# Altium schematic sheet Display.SchDoc
size A4; SheetNumber: 2; SheetTotal: 5
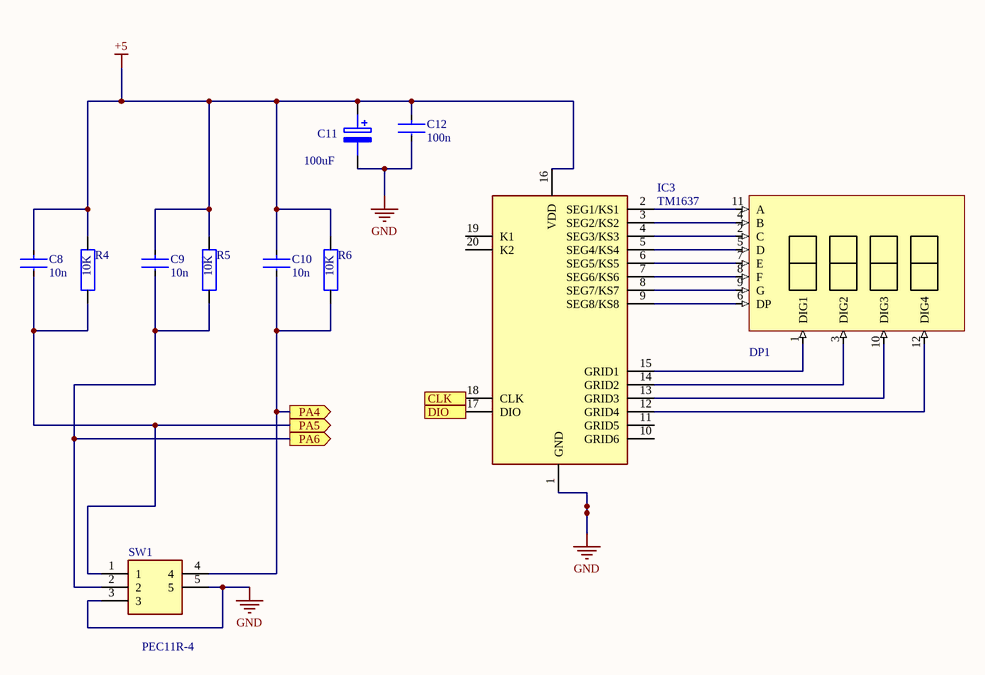
[diagram p0: Display.SchDoc]

## Parts
C8  10n  [FP-C0805C-DN-IPC_A]
C9  10n  [FP-C0805C-DN-IPC_A]
C10  10n  [FP-C0805C-DN-IPC_A]
C11  100uF  [caprad100mil]
C12  100n  [FP-C0805C-DN-IPC_A]
DP1  ELCO220uF  [display]  (value not drawn)
IC3  TM1637  [DIP778W53P254L2612H431Q20N]
R4  10K  [res0805ph]
R5  10K  [res0805ph]
R6  10K  [res0805ph]
SW1  PEC11R-4  [PEC12R-4XXXF-SXXXX_1]

## Ports
CLK (out), DIO (out), PA4 (out), PA5 (out), PA6 (out)

## Nets
+5: C8.1 C9.1 C10.1 C11.1(+) C12.1 IC3.16(VDD) R4.1 R5.1 R6.1
GND: C11.2(-) C12.2 IC3.1(GND) SW1.3 SW1.5
CLK: IC3.18(CLK) ; port CLK
DIO: IC3.17(DIO) ; port DIO
PA4: C10.2 R6.2 SW1.4 ; port PA4
PA5: C8.2 R4.2 SW1.1 ; port PA5
PA6: C9.2 R5.2 SW1.2 ; port PA6
NetDP1_1: DP1.1(DIG1) IC3.15(GRID1)
NetDP1_2: DP1.2(C) IC3.4(SEG3/KS3)
NetDP1_3: DP1.3(DIG2) IC3.14(GRID2)
NetDP1_4: DP1.4(B) IC3.3(SEG2/KS2)
NetDP1_5: DP1.5(D) IC3.5(SEG4/KS4)
NetDP1_6: DP1.6(DP) IC3.9(SEG8/KS8)
NetDP1_7: DP1.7(E) IC3.6(SEG5/KS5)
NetDP1_8: DP1.8(F) IC3.7(SEG6/KS6)
NetDP1_9: DP1.9(G) IC3.8(SEG7/KS7)
NetDP1_10: DP1.10(DIG3) IC3.13(GRID3)
NetDP1_11: DP1.11(A) IC3.2(SEG1/KS1)
NetDP1_12: DP1.12(DIG4) IC3.12(GRID4)

Not connected (* = marked no-connect by the designer): IC3 10(GRID6) 11(GRID5) 19(K1) 20(K2)

## Library data of the parts
C8-C10 C12 = CMP-2007-00259-2: CAP CER 10000PF 200V X7R 0805; Manufacturer Part Number: C0805C103K2RACTU; Manufacturer: KEMET; Material: Ceramic; Temperature Coefficient: 30ppm/°C; Capacitance: 10,000 pF; Tolerance: 0.1; Value: 10,000 pF; Device Class L2: Capacitors; Voltage Rating: 200 V; Temperature Range High: +125°C; ComponentLink2Description: Datasheet; Height: 0.88mm; Octopart: https://octopart.com/c0805c103k2ractu-kemet-9138347; ComponentLink2URL: https://content.kemet.com/datasheets/KEM_C1003_C0G_SMD.pdf; Category: Cap; Temperature: -55°C to +125°C; Temperature Range Low: -55°C; Digikey Description: CAP CER 10000PF 200V X7R 0805; Temperature Characteristic: X7R; Automotive: No; Device Class L3: Ceramic Capacitors; Mouser Description: KEMET - C0805C103K2RACTU - CAP, MLCC, X7R, 10NF, 200V, 0805; RoHS: TRUE; Device Class L1: Passive Components; Lead Free: Yes; Package: C0805C-DN; Ipc Land Pattern Name: CAPC200125X78
C11 = ELCO220uF: Capacitor Polarised; Manufacturer_Name: Kemet; Manufacturer_Part_Number: T494D227K006AT; Datasheet Link: https://datasheet.datasheetarchive.com/originals/distributors/Datasheets-DGA21/1893029.pdf; Height: 3.1mm; Mouser Part Number: 80-T494D227K006; Mouser Price/Stock: https://www.mouser.co.uk/ProductDetail/KEMET/T494D227K006AT/?qs=KZyWKl2lJVCDSHmnBye8LQ%3D%3D
DP1 = Display: Capacitor Polarised; Manufacturer_Name: Kemet; Manufacturer_Part_Number: T494D227K006AT; Datasheet Link: https://datasheet.datasheetarchive.com/originals/distributors/Datasheets-DGA21/1893029.pdf; Height: 3.1mm; Mouser Part Number: 80-T494D227K006; Mouser Price/Stock: https://www.mouser.co.uk/ProductDetail/KEMET/T494D227K006AT/?qs=KZyWKl2lJVCDSHmnBye8LQ%3D%3D
IC3 = TM1637: Integrated Circuit; Manufacturer_Name: TITAN MICRO ELECTRONICS; Height: 4.31mm; Manufacturer_Part_Number: TM1637
R4-R6 = Res: Resistor; Manufacturer_Name: TE Connectivity; Manufacturer_Part_Number: CPF0201D10K2C1; Datasheet Link: http://www.te.com/commerce/DocumentDelivery/DDEController?Action=showdoc&DocId=Data+Sheet%7F1773200-1%7FA%7Fpdf%7FEnglish%7FENG_DS_1773200-1_A.pdf%7F4-2176215-6; Height: 0.28mm; Mouser Part Number: N/A; Mouser Price/Stock: https://www.mouser.com/Search/Refine.aspx?Keyword=N%2FA
SW1 = PEC11R-4225F-S0024: Undefined or Miscellaneous; Manufacturer_Name: Bourns; Datasheet Link: https://componentsearchengine.com//PEC11R-4225F-S0024.pdf; Mouser2 Part Number: 652-PEC11R-4225F-S24; Mouser2 Price/Stock: https://www.mouser.com/Search/Refine.aspx?Keyword=652-PEC11R-4225F-S24; Manufacturer_Part_Number: PEC11R-4225F-S0024